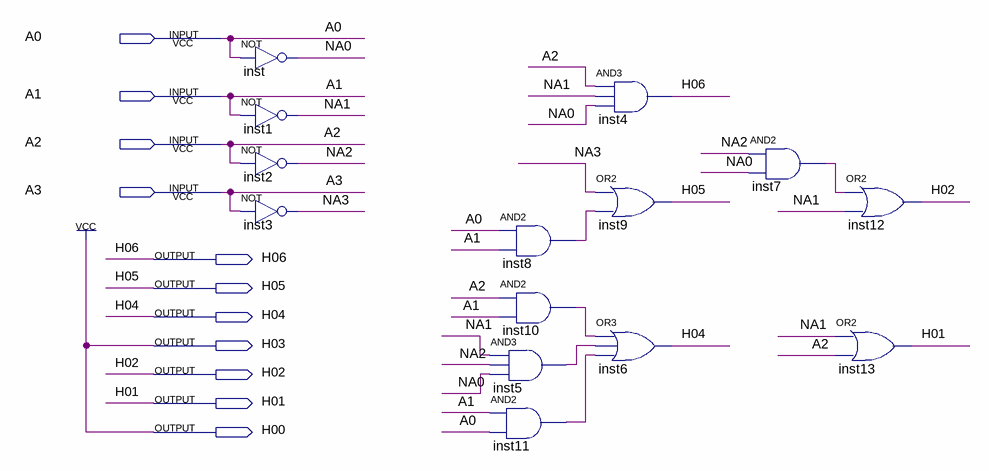
[diagram p0: schematic sheet]
// Quartus schematic HEX0.bdf as structural Verilog: 14 symbols, 11 pins
module HEX0 (
  input  A0,
  input  A1,
  input  A2,
  input  A3,
  output H06,
  output H05,
  output H04,
  output H03,
  output H02,
  output H01,
  output H00
);

  wire inst5_out, inst7_out, inst8_out, inst10_out, inst11_out, NA0, NA1, NA2, NA3;

  not inst (NA0, A0);
  not inst1 (NA1, A1);
  not inst2 (NA2, A2);
  not inst3 (NA3, A3);
  and inst8 (inst8_out, A0, A1);
  and inst10 (inst10_out, A2, A1);
  and inst5 (inst5_out, NA1, NA2, NA0);
  and inst11 (inst11_out, A1, A0);
  and inst4 (H06, A2, NA1, NA0);
  or inst9 (H05, NA3, inst8_out);
  or inst6 (H04, inst10_out, inst5_out, inst11_out);
  and inst7 (inst7_out, NA2, NA0);
  or inst12 (H02, inst7_out, NA1);
  or inst13 (H01, NA1, A2);

  assign H00 = 1'b1;
  assign H03 = 1'b1;
endmodule
